# EAGLE design StripNanite (EAGLE 7.2.0)
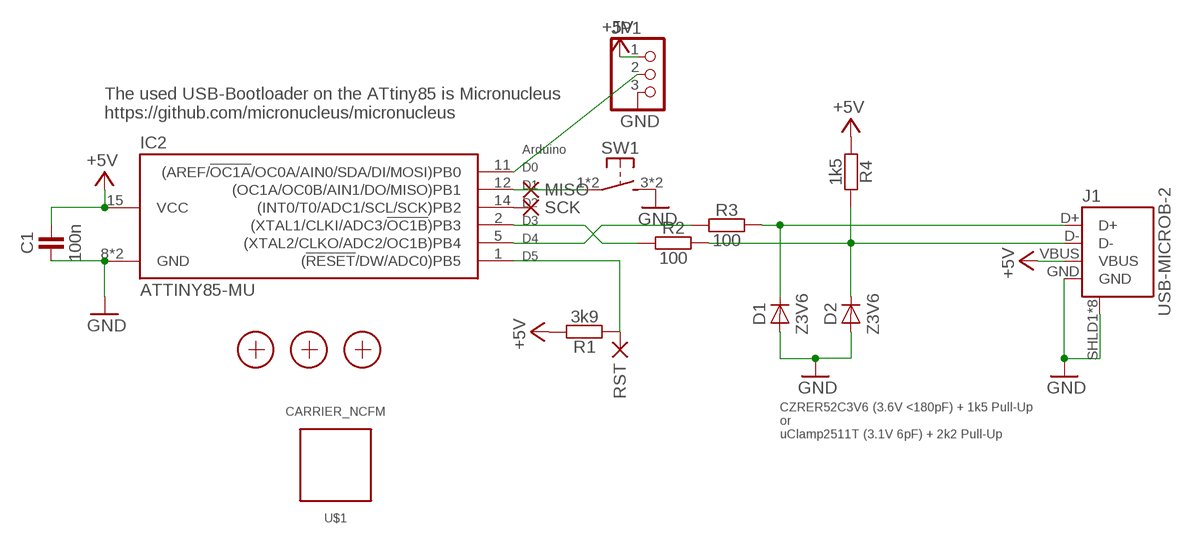
[diagram p0: schematic, sheet 1]

## Parts
C1  100n  CAPACITOR-0402  [C0402]
D1  Z3V6  DIODE-SOD882  [SOD882]
D2  Z3V6  DIODE-SOD882  [SOD882]
IC2  ATTINY85-MU  [QFN20-PAD]
J1  USB-MICROB-2  [USB-MICROB-10118194]
JP1  PINHD-1X3  [1X03]
MISO  PAD-1.0  [PAD-1.0]
R1  3k9  RESISTOR-0402  [C0402]
R2  100  RESISTOR-0402  [C0402]
R3  100  RESISTOR-0402  [C0402]
R4  1k5  RESISTOR-0402  [C0402]
RST  PAD-1.0  [PAD-1.0]
SCK  PAD-1.0  [PAD-1.0]
SW1  SW-TACTILE-PTS840P  [PTS840P]
U$1  CARRIER_NCFM  [FM]
X1  PASSER-07  [PASSER_07MM]
X2  PASSER-07  [PASSER_07MM]
X3  PASSER-07  [PASSER_07MM]

## Nets
+5V: C1.2 IC2.15(VCC) J1.VBUS JP1.1 R1.2 R4.1
D_P: D1.C J1.D+ R3.2
GND: C1.1 D1.A D2.A IC2.8(GND) IC2.TP(GND) J1.GND J1.SHLD1(SHIELD) J1.SHLD2(SHIELD) J1.SHLD3(SHIELD) J1.SHLD4(SHIELD) J1.SHLD5(SHIELD) J1.SHLD6(SHIELD) J1.SHLD7(SHIELD) J1.SHLD8(SHIELD) JP1.3 SW1.3(S1) SW1.4(S1)
N$1: IC2.11((AREF/!OC1A!/OC0A/AIN0/SDA/DI/MOSI)PB0) JP1.2
N$2: D2.C J1.D- R2.2 R4.2
N$3: IC2.14((INT0/T0/ADC1/SCL/SCK)PB2) SCK.1(P)
N$4: IC2.12((OC1A/OC0B/AIN1/DO/MISO)PB1) MISO.1(P) SW1.1 SW1.2(P1)
PB3: IC2.2((XTAL1/CLKI/ADC3/!OC1B!)PB3) R2.1
PB4: IC2.5((XTAL2/CLKO/ADC2/OC1B)PB4) R3.1
PB5: IC2.1((!RESET!/DW/ADC0)PB5) R1.1 RST.1(P)

## Notes on the sheet
- ATtiny85 AVR
- The used USB-Bootloader on the ATtiny85 is Micronucleus 
  https://github.com/micronucleus/micronucleus
- Arduino
- D0
- D1
- D2
- D3
- D4
- D5
- CZRER52C3V6 (3.6V <180pF) + 1k5 Pull-Up 
  or
  uClamp2511T (3.1V 6pF) + 2k2 Pull-Up

## Library data of the parts
C1 = we-rcl:CAPACITOR: Capacitors ...2.2uF @ 6.3V -> 0402 ...4.7uF @ 6.3V -> 0603 ...10uF @ 16V -> 0805 ...22uF @ 25V -> 1206
D1 D2 = we-rcl:DIODE: Diodes
IC2 = we-chip:ATTINY85: Atmel ATtiny25/45/85 AVR Microcontroller; DIGIKEY: ATTINY85-20MURDKR-ND
J1 = we-con:USB: USB Connectors; DIGIKEY: 609-4618-6-ND
JP1 = pinhead:PINHD-1X3: PIN HEADER
MISO RST SCK = we-rcl:PAD: Pads and Test-Points
R1-R4 = we-rcl:RESISTOR: Resistors all kinds in 0402 and 0603
SW1 = we-switch:SW-TACTILE: Tactile Switches; DIGIKEY: CKN10511DKR-ND
U$1 = thar:CARRIER_NC: funktionslose Formen -Text -Logo -Trägerform
X1-X3 = we-symbol:PASSER: Fiducial Markers

## Board
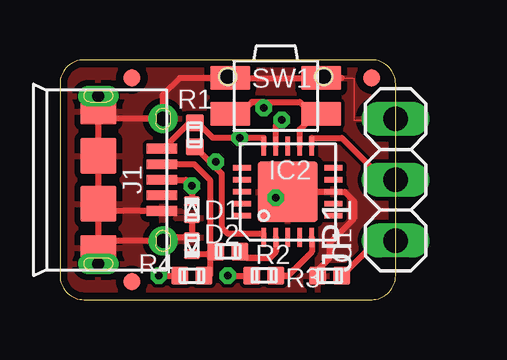
[diagram p1: board, top side]
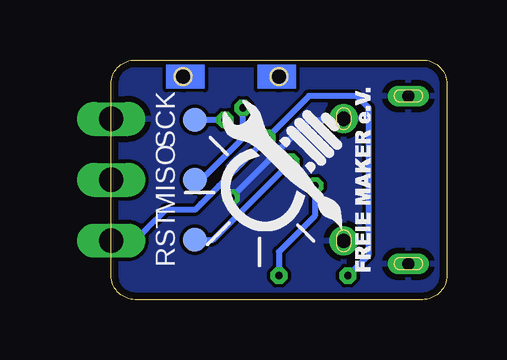
[diagram p2: board, bottom side, seen from below]

Size 14 x 10 mm. Coordinates in mm from the lower left corner, seen from the top.
Outline: 0,1 arc90 1,0 1.5,0 13,0 arc90 14,1 14,9 arc90 13,10 1.5,10 1,10 arc90 0,9 0,1
Copper layers (1*16): Top 0.035mm / dielectric 1.5mm / Bottom 0.035mm
Design rules "we-dru *": minimum track width 0.15mm, minimum drill 0.3mm, track to track 0.15mm, track to pad 0.15mm, pad to pad 0.15mm, via to via 0.15mm, smd to smd 0.1mm, copper to edge 0.3mm, drill to drill 0.2mm, minimum pad ring 0.18mm, minimum via ring 0.2mm, stop-mask expansion 0.1mm, vias tented up to drill 0.5mm, thermal gap 0.25mm

### Footprints (pad centres in the part's own frame; a part is rotated, then mirrored left to right if it is on the bottom)
C0402 = smd 0.75 x 0.7: 1 0,0.5; 2 0,-0.5
SOD882 = smd 0.65 x 0.4: A 0,-0.35; C 0,0.35
QFN20-PAD = smd 0.8 x 0.26: 1 -1.9,1; 2 -1.9,0.5; 3 -1.9,0; 4 -1.9,-0.5; 5 -1.9,-1; 11 1.9,-1; 12 1.9,-0.5; 13 1.9,0; 14 1.9,0.5; 15 1.9,1 | smd 0.26 x 0.8: 6 -1,-1.9; 7 -0.5,-1.9; 8 0,-1.9; 9 0.5,-1.9; 10 1,-1.9; 16 1,1.9; 17 0.5,1.9; 18 0,1.9; 19 -0.5,1.9; 20 -1,1.9 | smd 2.5 x 2.5: TP 0,0
USB-MICROB-10118194 = smd 1.3 x 0.4: D+ -2.5,0; D- -2.5,-0.65; GND -2.5,1.3; ID -2.5,0.65; VBUS -2.5,-1.3 | drill 0.6 pad 1.2: SHLD1 -2.55,2.55; SHLD2 -2.55,-2.55 | drill 0.5 pad 0.8 long: SHLD3 0.15,3.5; SHLD4 0.15,-3.5 | smd 1.5 x 1.1: SHLD5 0.15,2.85; SHLD6 0.15,-2.85 | smd 1.5 x 1.5: SHLD7 0.15,1; SHLD8 0.15,-1
1X03 = drill 1.016 long: 1 -2.54,0; 2 0,0; 3 2.54,0
PAD-1.0 = smd 1 x 1: 1 0,0
PTS840P = smd 1.65 x 1: 1 -1.9,0.75; 2 1.9,0.75; 3 -1.9,-0.75; 4 1.9,-0.75 | hole 0.7: -2,-0.8; 2,-0.8
PASSER_07MM = smd 0.7 x 0.7: X 0,0

### Placement (x,y rotation side)
C1  11.25,1 90 top
D1  5.5,3.75 0 top
D2  5.5,2.25 180 top
IC2  9.5,4.5 90 top
J1  1.75,5 180 top
JP1  14,5 90 top
MISO  10.5,5 0 bottom
R1  5.62,6.88 180 top
R2  7,2 270 top
R3  8.5,1 270 top
R4  5.5,1 90 top
RST  10.5,2.5 0 bottom
SCK  10.5,7.5 0 bottom
SW1  9,8.5 180 top
U$1  6.75,4.75 90 bottom
X1  13,9.25 0 top
X2  3,0.75 0 top
X3  3,9.25 0 top

### Tracks (layer width: path | path; a pad name or v marks a point on that pad's centre or on a via)
+5V  (via drill 0.3)
  Top 0.25: 4.55,6.3 J1.VBUS 4.55,6.3 | 7.75,6.75 v7.5,6.75 | IC2.15 8.5,6.75 7.75,6.75 | C1.2 11.79,1 | 11.79,1 C1.2 | C1.2 11.79,1 | v4.12,1 4.75,1 R4.1 | 7.75,6.75 6.38,6.75 5.62,7.5 | 5.62,7.5 5.5,7.5 4.25,6.25 4.55,6.3 | R1.2 5.62,7.5 | C1.2 13,2.25 13.21,2.46 JP1.1
  Bottom 0.25: v4.12,1 3.25,1.88 3.25,8 3.75,8.5 5.75,8.5 v7.5,6.75 9,5.25 9.5,4.75 10.25,4 10.5,3.75 11,3.75 11.71,3.75 12.5,2.96 13,2.46 JP1.1
D_P  (via drill 0.3)
  Top 0.25: J1.D+ 5.25,5 v5.5,4.75 D1.C | v7,1 R3.2
  Bottom 0.25: v5.5,4.75 5.5,3.5 7,2 v7,1
GND  (via drill 0.3)
  Top 0: 11.75,9.25 12.25,9.25 12.25,7.5 13.96,7.5 JP1.3
  Top 0.25: J1.SHLD4 J1.SHLD6 | J1.SHLD6 J1.SHLD8 J1.SHLD7 1.6,3.5 | 1.6,3.5 J1.SHLD5 | J1.SHLD5 J1.SHLD3 | J1.GND 1.8,3.7 1.6,3.5 | J1.SHLD1 1.9,2.45 J1.SHLD5 | J1.SHLD6 1.9,7.55 J1.SHLD2 4.3,8.55 5,9.25 5.75,9.25 SW1.4 SW1.3 11.75,9.25 | 4.35,2.5 J1.SHLD1 | IC2.8 9.25,4.5 | 9.25,4.5 v9,4.25 9.25,4.5 | IC2.8 9.25,4.5 | IC2.8 11.88,4.5 12.25,4.12 12.25,3.38 11.25,2.38 11.25,1.75 10.75,1.25 C1.1 | D1.A D2.A 4.3,2.6 J1.SHLD1 | JP1.3 13.46,7.54
  Bottom 0.25: v9,4.25 5.75,7.5 4.35,7.5 J1.SHLD2
  pour Top: 0,0 14,0 14,10 0,10
  pour Bottom: 0,0 14,0 14,10 0,10
N$1
  Top 0.25: IC2.11 10.5,6.75 11.75,6.75 12,6.5 | 12,6.5 12.1,6.4 | 12,6.5 13,5.5 13.5,5 JP1.2
N$2
  Top 0.25: J1.D- 5.6,5.65 6.25,5 6.25,2 | 6.1,0.75 R4.2 6.25,1 6.25,1.75 | 6.25,2 6.25,1.75 | R2.2 6.25,1.75 | D2.C 6.25,1.9 6.25,2
N$3  (via drill 0.3)
  Top 0.25: IC2.14 9,7.25 v9.25,7.5
  Bottom 0.25: v9.25,7.5 SCK.1
N$4  (via drill 0.3)
  Top 0.25: IC2.12 10,7.1 10.65,7.75 SW1.1 10.5,7.75 10,8.25 8.5,8.25 | SW1.2 7.5,7.75 8,8.25 | 8,8.25 8.5,8.25 | 8.5,8.25 8,8.25 | 8,8.25 8.5,8.25 | v8.5,8 8.5,8.25
  Bottom 0.25: MISO.1 10.25,5 8.5,6.75 v8.5,8
PB3
  Top 0.25: R2.1 7.75,1.75 | 7.75,1.75 8.75,1.75 | 8.75,1.75 7.75,1.75 | 7.75,1.75 R2.1 | R2.1 7.75,1.75 | 7.75,1.75 8.75,1.75 | 8.75,1.75 7.75,1.75 | 8.75,1.75 7.75,1.75 | IC2.2 9,2 8.75,1.75
PB4
  Top 0.25: 9.5,1 R3.1 9.5,1 | 9.5,1 9.75,1.25 | 9.75,1.25 9.5,1 | 9.75,1.25 9.5,1 | IC2.5 10.5,2 9.75,1.25
PB5  (via drill 0.3)
  Top 0.25: 6.38,5.62 6.75,5.25 6.75,5 6.75,3 7,2.75 8,2.75 8.25,2.75 8.41,2.75 8.5,2.75 IC2.1 | 6.38,5.62 6,6 5.88,6.12 R1.1 | v6.5,5.75 6.38,5.62
  Bottom 0.25: RST.1 9.75,2.5 v6.5,5.75